# Altium schematic sheet main.SchDoc
size C
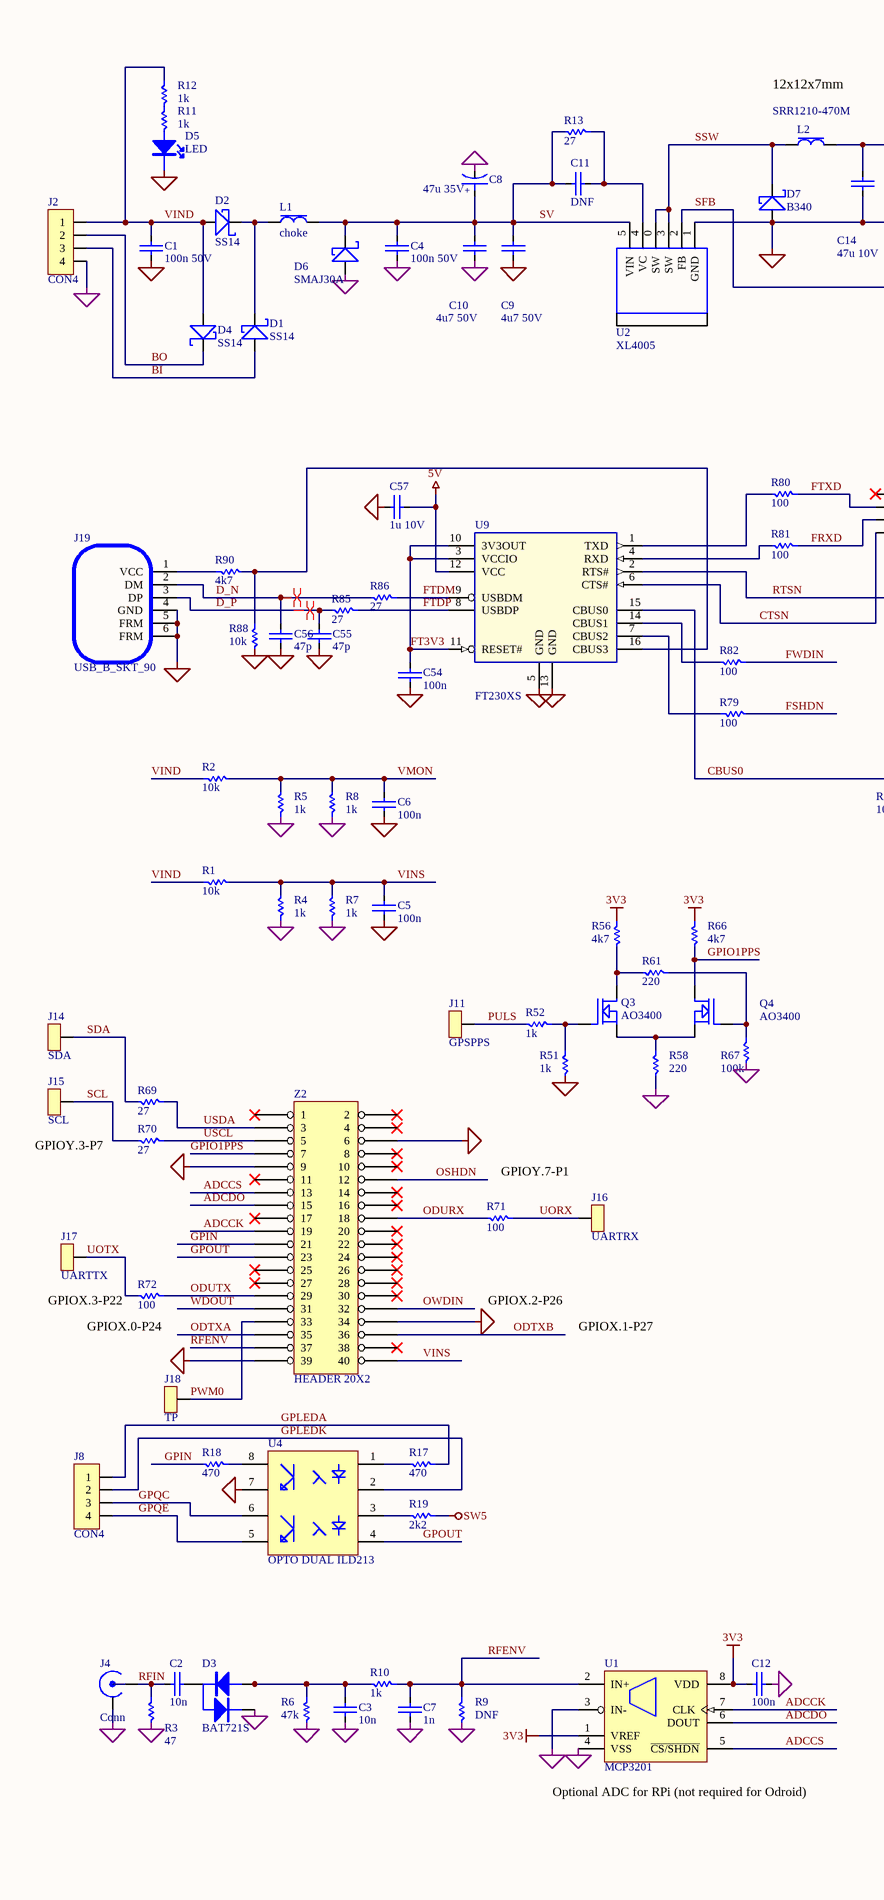
[diagram p0: main.SchDoc, left]
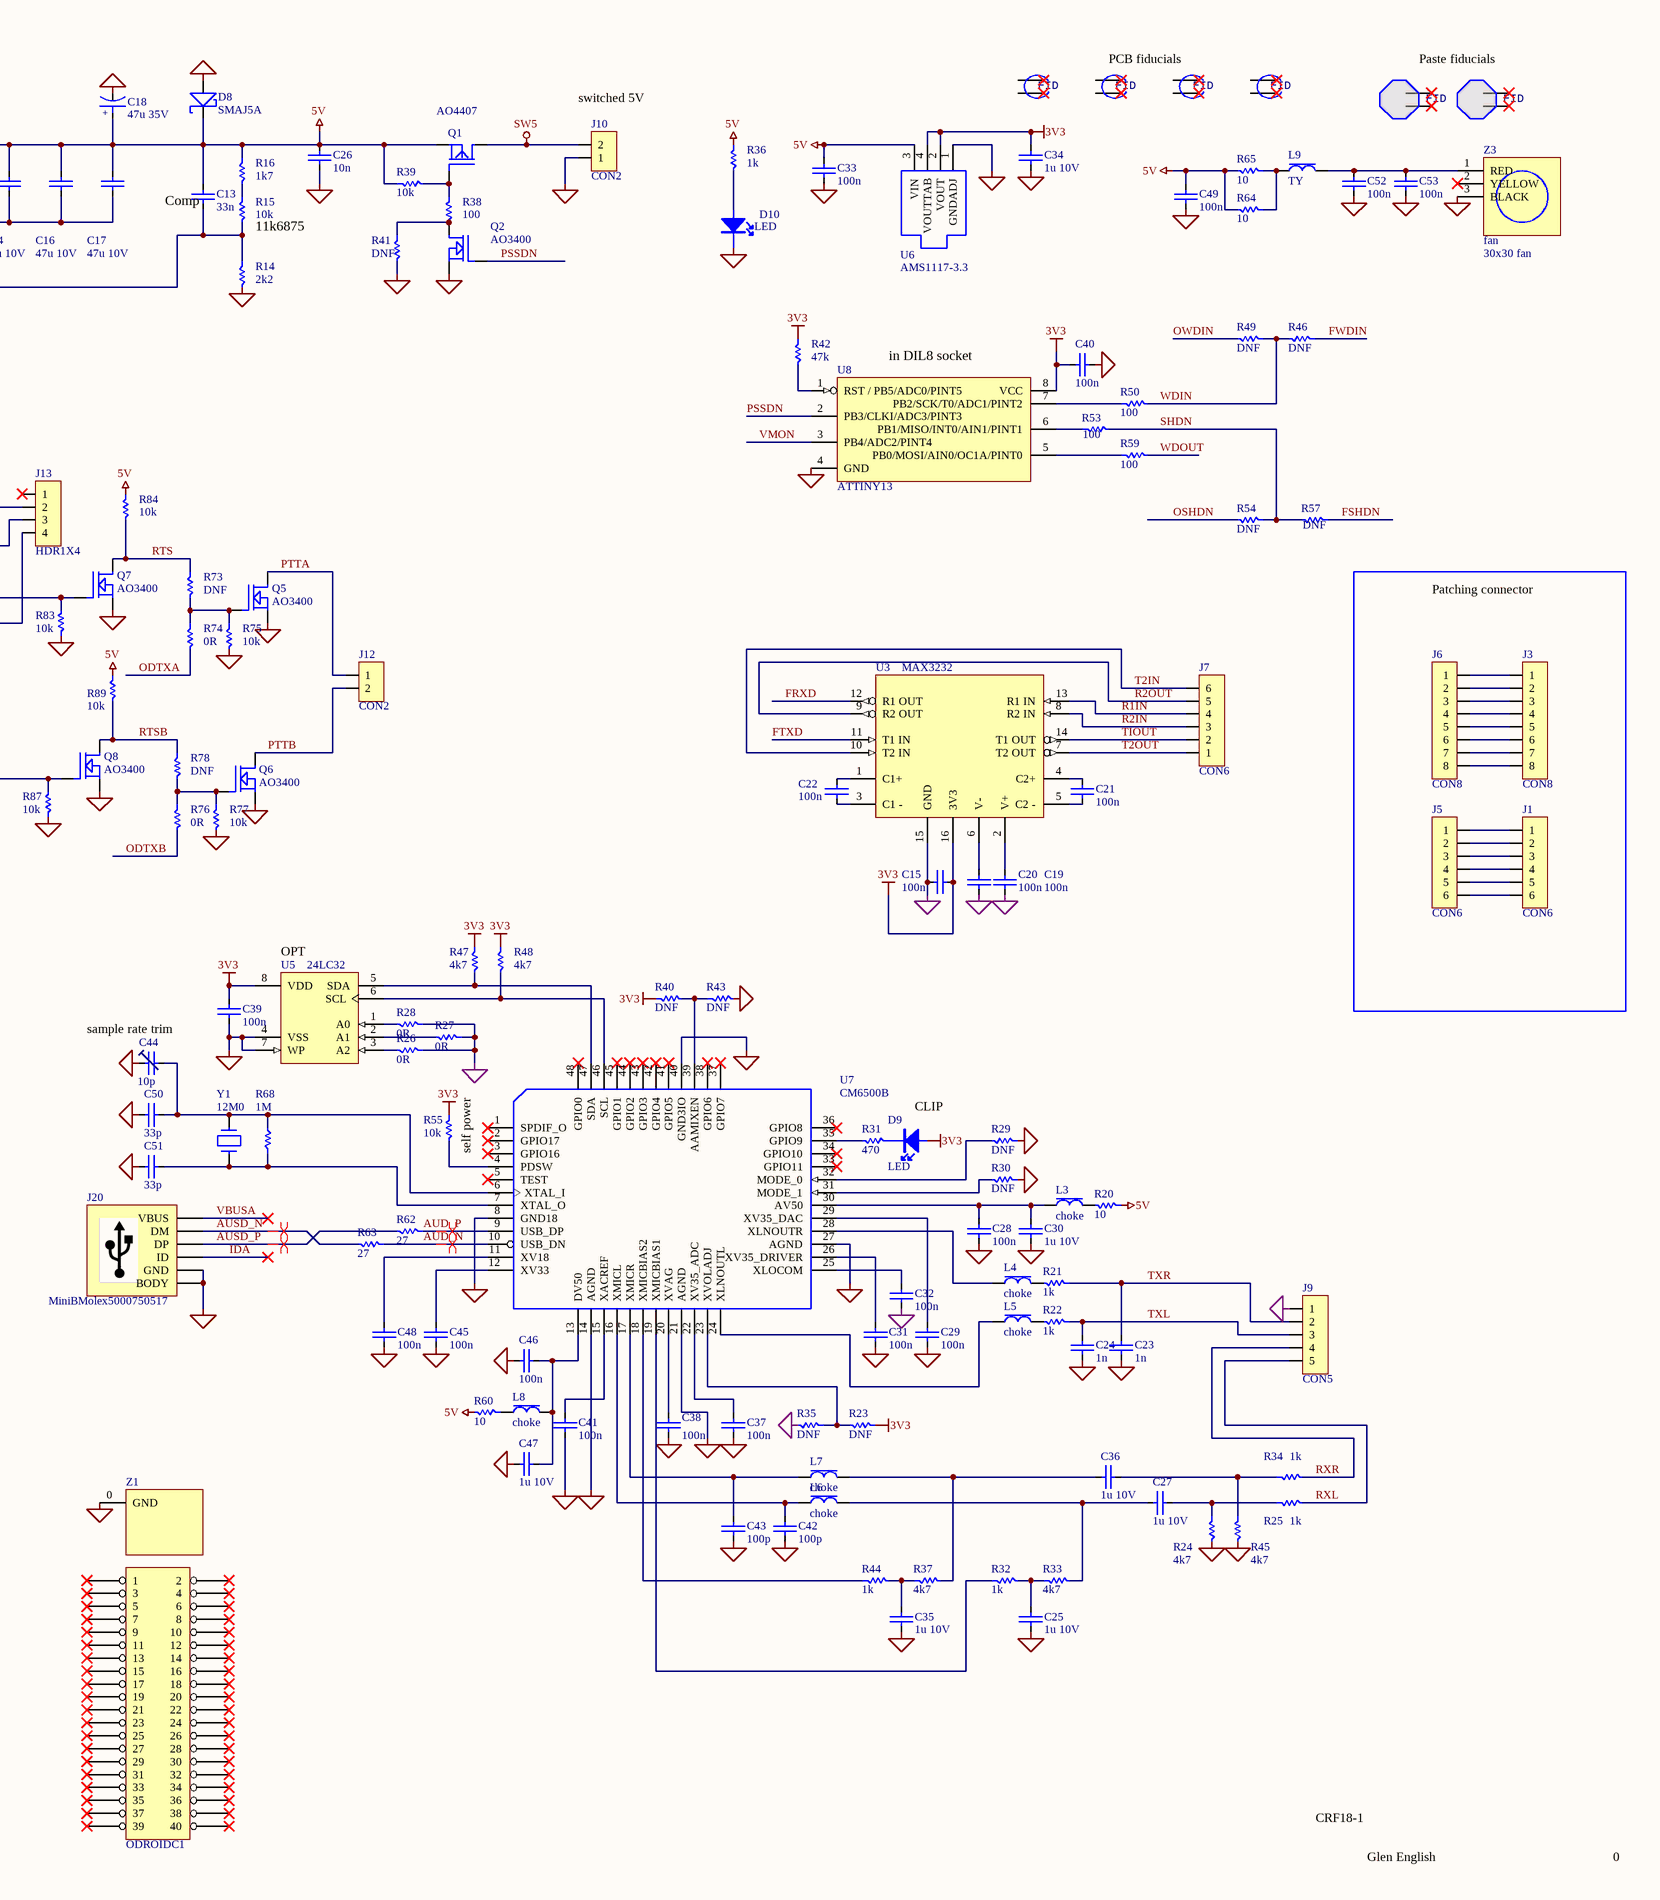
[diagram p1: main.SchDoc, right]

## Parts
C1  100n 50V  [0603C]
C2  10n  [0603C]
C3  10n  [0603C]
C4  100n 50V  [0603C]
C5  100n  [0603C]
C6  100n  [0603C]
C7  1n  [0603C]
C8  47u 35V  [D_CASE_ELECTRO]
C9  4u7 50V  [1206C]
C10  4u7 50V  [1206C]
C11  DNF  [0603C]
C12  100n  [0603C]
C13  33n  [0603C]
C14  47u 10V  [1206C]
C15  100n  [0603C]
C16  47u 10V  [1206C]
C17  47u 10V  [1206C]
C18  47u 35V  [D_CASE_ELECTRO]
C19  100n  [0603C]
C20  100n  [0603C]
C21  100n  [0603C]
C22  100n  [0603C]
C23  1n  [0603C]
C24  1n  [0603C]
C25  1u 10V  [0603C]
C26  10n  [0603C]
C27  1u 10V  [0603C]
C28  100n  [0603C]
C29  100n  [0603C]
C30  1u 10V  [0603C]
C31  100n  [0603C]
C32  100n  [0603C]
C33  100n  [0603C]
C34  1u 10V  [0603C]
C35  1u 10V  [0603C]
C36  1u 10V  [0603C]
C37  100n  [0603C]
C38  100n  [0603C]
C39  100n  [0603C]
C40  100n  [0603C]
C41  100n  [0603C]
C42  100p  [0603C]
C43  100p  [0603C]
C44  10p  [CAP0.1]
C45  100n  [0603C]
C46  100n  [0603C]
C47  1u 10V  [0603C]
C48  100n  [0603C]
C49  100n  [0603C]
C50  33p  [0603C]
C51  33p  [0603C]
C52  100n  [0603C]
C53  100n  [0603C]
C54  100n  [0603C]
C55  47p  [0603C]
C56  47p  [0603C]
C57  1u 10V  [0603C]
D1  SS14  [SMA_DIODE]
D2  SS14  [SMA_DIODE]
D3  BAT721S  [SOT23]
D4  SS14  [SMA_DIODE]
D5  LED  [0805LED]
D6  SMAJ30A  [SMA_DIODE]
D7  B340  [SMB_diode]
D8  SMAJ5A  [SMA_DIODE]
D9  LED  [0805LED]
D10  LED  [0805LED]
FID1  FIDUCIAL  [FIDUCIAL]  (value not drawn)
FID2  FIDUCIAL  [FIDUCIAL]  (value not drawn)
FID3  FIDUCIAL  [FIDUCIAL]  (value not drawn)
FID4  FIDUCIAL  [FIDUCIAL]  (value not drawn)
J1  CON6  [SL3.81/6/90G]
J2  CON4  [SL3.81/4/90G]
J3  CON8  [SL3.81/8/90G]
J4  Conn  [SMA_COMPACT_VERTICAL_PCB]
J5  CON6  [HDR1X6]
J6  CON8  [HDR1X8]
J7  CON6  [HDR1X6]
J8  CON4  [HDR1X4]
J9  CON5  [HDR1X5]
J10  CON2  [HDR1X2]
J11  GPSPPS  [GPPAD]
J12  CON2  [HDR1X2]
J13  HDR1X4  [HDR1X4]
J14  SDA  [GPPAD]
J15  SCL  [GPPAD]
J16  UARTRX  [GPPAD]
J17  UARTTX  [GPPAD]
J18  TP  [GPPAD]
J19  USB_B_SKT_90  [USB_B_SKT_90]
J20  MiniBMolex5000750517  [USB_UX60A-MB-5ST]
L1  choke  [1812L]
L2  SRR1210-470M  [BOURNS_SRR1210]
L3  choke  [0603L]
L4  choke  [0603L]
L5  choke  [0603L]
L6  choke  [0603L]
L7  choke  [0603L]
L8  choke  [0603L]
L9  TY  [0805L]
PFID1  PASTEFID  [FIDUCIAL_PASTE]  (value not drawn)
PFID2  PASTEFID  [FIDUCIAL_PASTE]  (value not drawn)
Q1  AO4407  [SO8FET]
Q2  AO3400  [FDV-301N_SOT23]
Q3  AO3400  [FDV-301N_SOT23]
Q4  AO3400  [FDV-301N_SOT23]
Q5  AO3400  [FDV-301N_SOT23]
Q6  AO3400  [FDV-301N_SOT23]
Q7  AO3400  [FDV-301N_SOT23]
Q8  AO3400  [FDV-301N_SOT23]
R1  10k  [0603R]
R2  10k  [0603R]
R3  47  [0603R]
R4  1k  [0603R]
R5  1k  [0603R]
R6  47k  [0603R]
R7  1k  [0603R]
R8  1k  [0603R]
R9  DNF  [0603R]
R10  1k  [0603R]
R11  1k  [0603R]
R12  1k  [0603R]
R13  27  [0603R]
R14  2k2  [0603R]
R15  10k  [0603R]
R16  1k7  [0603R]
R17  470  [0603R]
R18  470  [0603R]
R19  2k2  [0603R]
R20  10  [0603R]
R21  1k  [0603R]
R22  1k  [0603R]
R23  DNF  [0603R]
R24  4k7  [0603R]
R25  1k  [0603R]
R26  0R  [0603R]
R27  0R  [0603R]
R28  0R  [0603R]
R29  DNF  [0603R]
R30  DNF  [0603R]
R31  470  [0603R]
R32  1k  [0603R]
R33  4k7  [0603R]
R34  1k  [0603R]
R35  DNF  [0603R]
R36  1k  [0603R]
R37  4k7  [0603R]
R38  100  [0603R]
R39  10k  [0603R]
R40  DNF  [0603R]
R41  DNF  [0603R]
R42  47k  [0603R]
R43  DNF  [0603R]
R44  1k  [0603R]
R45  4k7  [0603R]
R46  DNF  [0603R]
R47  4k7  [0603R]
R48  4k7  [0603R]
R49  DNF  [0603R]
R50  100  [0603R]
R51  1k  [0603R]
R52  1k  [0603R]
R53  100  [0603R]
R54  DNF  [0603R]
R55  10k  [0603R]
R56  4k7  [0603R]
R57  DNF  [0603R]
R58  220  [0603R]
R59  100  [0603R]
R60  10  [0603R]
R61  220  [0603R]
R62  27  [0603R]
R63  27  [0603R]
R64  10  [1206R]
R65  10  [1206R]
R66  4k7  [0603R]
R67  100k  [0603R]
R68  1M  [0603R]
R69  27  [0603R]
R70  27  [0603R]
R71  100  [0603R]
R72  100  [0603R]
R73  DNF  [0603R]
R74  0R  [0603R]
R75  10k  [0603R]
R76  0R  [0603R]
R77  10k  [0603R]
R78  DNF  [0603R]
R79  100  [0603R]
R80  100  [0603R]
R81  100  [0603R]
R82  100  [0603R]
R83  10k  [0603R]
R84  10k  [0603R]
R85  27  [0603R]
R86  27  [0603R]
R87  10k  [0603R]
R88  10k  [0603R]
R89  10k  [0603R]
R90  4k7  [0603R]
U1  MCP3201  [DIP8]
U2  XL4005  [TO263-5]
U3  MAX3232  [SO16]
U4  OPTO DUAL ILD213  [SO8]
U5  24LC32  [SO8]
U6  AMS1117-3.3  [SOT223]
U7  CM6500B  [QFP48_7x7]
U8  ATTINY13  [DIP8]
U9  FT230XS  [TSSOP16]
Y1  12M0  [HC49]
Z1  ODROIDC1  [ODROID_C1]
Z2  HEADER 20X2  [HDR2X20_100MIL]
Z3  fan  [FAN_SUNON_MC3006]

## Blocks framed on the sheet
Patching connector: J1 J3 J5 J6

## Nets
3V3: C12.1 C15.1 C34.1 C39.2 C40.1 D9.A R23.1 R40.1 R42.1 R47.1 R48.1 R55.1 R56.1 R66.1 U1.1(VREF) U1.8(VDD) U3.16(3V3) U5.8(VDD) U6.2(VOUT) U6.4(VOUTTAB) U8.8(VCC)
5V: C13.1 C14.1 C16.1 C17.1 C18.1 C26.1 C33.1 C49.1 C57.1 D8.K(CATHODE) L2.2 Q1.S R16.1 R20.1 R36.1 R39.1 R60.2 R64.2 R65.2 R84.1 R89.1 U6.3(VIN) U9.12(VCC)
GND: C1.2 C3.2 C4.2 C5.2 C6.2 C7.1 C8.2 C9.2 C10.2 C12.2 C14.2 C15.2 C16.2 C17.2 C18.2 C19.1 C20.1 C23.2 C24.2 C25.2 C26.2 C28.1 C29.2 C30.1 C31.2 C32.2 C33.2 C34.2 C35.2 C37.2 C38.2 C39.1 C40.2 C41.2 C42.2 C43.2 C44.1 C45.2 C46.1 C47.1 C48.2 C49.2 C50.2 C51.2 C52.2 C53.2 C54.2 C55.1 C56.1 C57.2 D3.2(K2) D5.K D6.A(ANODE) D7.A(ANODE) D8.A(ANODE) D10.K J2.4 J4.1 J9.1 J10.1 J19.4(GND) J19.5(FRM) J19.6(FRM) J20.BODY J20.GND Q2.S Q5.S Q6.S Q7.S Q8.S R3.2 R4.1 R5.1 R6.2 R7.1 R8.1 R9.2 R14.2 R24.2 R26.1 R27.1 R28.1 R29.1 R30.1 R35.2 R41.2 R43.2 R45.2 R51.2 R58.2 R67.2 R75.2 R77.2 R83.1 R87.1 R88.2 U1.3(IN-) U1.4(VSS) U2.1(GND) U3.15(GND) U4.7(1E) U5.4(VSS) U5.7(WP) U6.1(GNDADJ) U7.8(GND18) U7.14(AGND) U7.21(AGND) U7.27(AGND) U7.40(GND3IO) U8.4(GND) U9.5(GND) U9.13(GND) Z1.0(GND) Z2.6 Z2.9 Z2.34 Z2.39 Z3.3(BLACK)
SW5: J10.2 Q1.D R19.1
ADCCK: U1.7(CLK) Z2.19
ADCCS: U1.5(~{CS/SHDN}) Z2.13
ADCDO: U1.6(DOUT) Z2.15
AUD_N: R63.1 U7.10(USB_DN)
AUD_P: R62.1 U7.9(USB_DP)
AUSD_N: J20.DM R63.2
AUSD_P: J20.DP R62.2
BI: D1.A(ANODE) J2.3
BO: D4.K(CATHODE) J2.2
CBUS0: Q8.G R87.2 U9.15(CBUS0)
CTSN: J13.4 U9.6(CTS#)
D_N: C56.2 J19.2(DM) R86.2
D_P: C55.2 J19.3(DP) R85.2
FRXD: J13.3 R81.1 U3.12(R1_OUT)
FSHDN: R57.1 R79.2
FT3V3: C54.1 U9.3(VCCIO) U9.10(3V3OUT) U9.11(RESET#)
FTDM: R86.1 U9.9(USBDM)
FTDP: R85.1 U9.8(USBDP)
FTXD: J13.2 R80.1 U3.11(T1_IN)
FWDIN: R46.1 R82.1
GPIN: R18.2 Z2.21
GPIO1PPS: Q4.D R66.2 Z2.7
GPLEDA: J8.1 R17.1
GPLEDK: J8.2 U4.2(1K)
GPOUT: U4.4(2K) Z2.23
GPQC: J8.3 U4.6(2C)
GPQE: J8.4 U4.5(2E)
IDA: J20.ID
ODTXA: R74.2 Z2.35
ODTXB: R76.2 Z2.36
ODURX: R71.2 Z2.18
ODUTX: R72.1 Z2.29
OSHDN: R54.2 Z2.12
OWDIN: R49.2 Z2.32
PSSDN: Q2.G U8.2(PB3/CLKI/ADC3/PINT3)
PTTA: J12.1 Q5.D
PTTB: J12.2 Q6.D
PULS: J11.0(TP) R52.2
PWM0: J18.0(TP) Z2.33
R1IN: J7.4 U3.13(R1_IN)
R2IN: J7.3 U3.8(R2_IN)
R2OUT: J7.5 U3.9(R2_OUT)
RFENV: C7.2 R9.1 R10.1 U1.2(IN+) Z2.37
RFIN: C2.1 J4.2 R3.1
RTS: Q7.D R73.1 R84.2
RTSB: Q8.D R78.1 R89.2
RTSN: Q7.G R83.2 U9.2(RTS#)
RXL: J9.5 R25.2
RXR: J9.4 R34.2
SCL: J15.0(TP) R70.2
SDA: J14.0(TP) R69.2
SFB: C13.2 R14.1 R15.2 U2.2(FB)
SHDN: R53.2 R54.1 R57.2
SSW: D7.K(CATHODE) L2.1 U2.0(SW) U2.3(SW)
SV: C4.1 C8.1 C9.1 C10.1 C11.1 D6.K(CATHODE) L1.2 R13.2 U2.5(VIN)
T2IN: J7.6 U3.10(T2_IN)
T2OUT: J7.1 U3.7(T2_OUT)
TIOUT: J7.2 U3.14(T1_OUT)
TXL: C24.1 J9.3 R22.1
TXR: C23.1 J9.2 R21.1
UORX: J16.0(TP) R71.1
UOTX: J17.0(TP) R72.2
USCL: R70.1 Z2.5
USDA: R69.1 Z2.3
VBUSA: J20.VBUS
VIND: C1.1 D2.A(ANODE) D4.A(ANODE) J2.1 R1.1 R2.1 R12.1
VINS: C5.1 R1.2 R4.2 R7.2 Z2.40
VMON: C6.1 R2.2 R5.2 R8.2 U8.3(PB4/ADC2/PINT4)
WDIN: R46.2 R49.1 R50.2
WDOUT: R59.2 Z2.31
NetC2_2: C2.2 D3.3(B)
NetC3_1: C3.1 D3.1(K1) R6.1 R10.2
NetC11_2: C11.2 R13.1 U2.4(VC)
NetC19_2: C19.2 U3.2(V+)
NetC20_2: C20.2 U3.6(V-)
NetC21_1: C21.1 U3.4(C2+)
NetC21_2: C21.2 U3.5(C2_-)
NetC22_1: C22.1 U3.1(C1+)
NetC22_2: C22.2 U3.3(C1_-)
NetC25_1: C25.1 R32.2 R33.1
NetC27_1: C27.1 L6.2 R33.2
NetC27_2: C27.2 R24.1 R25.1
NetC28_2: C28.2 C30.2 L3.1 U7.30(AV50)
NetC29_1: C29.1 U7.29(XV35_DAC)
NetC31_1: C31.1 U7.26(XV35_DRIVER)
NetC32_1: C32.1 U7.25(XLOCOM)
NetC35_1: C35.1 R37.1 R44.2
NetC36_1: C36.1 L7.2 R37.2
NetC36_2: C36.2 R34.1 R45.1
NetC37_1: C37.1 U7.22(XV35_ADC)
NetC38_1: C38.1 U7.20(XVAG)
NetC41_1: C41.1 U7.15(XACREF)
NetC42_1: C42.1 L6.1 U7.16(XMICL)
NetC43_1: C43.1 L7.1 U7.17(XMICR)
NetC44_2: C44.2 C50.1 R68.2 U7.6(XTAL_I) Y1.1
NetC45_1: C45.1 U7.12(XV33)
NetC46_2: C46.2 C47.2 L8.2 U7.13(DV50)
NetC48_1: C48.1 U7.11(XV18)
NetC51_1: C51.1 R68.1 U7.7(XTAL_O) Y1.2
NetC52_1: C52.1 C53.1 L9.2 Z3.1(RED)
NetD1_K: D1.K(CATHODE) D2.K(CATHODE) L1.1
NetD5_A: D5.A R11.2
NetD9_K: D9.K R31.1
NetD10_A: D10.A R36.2
NetJ1_1: J1.1 J5.1
NetJ1_2: J1.2 J5.2
NetJ1_3: J1.3 J5.3
NetJ1_4: J1.4 J5.4
NetJ1_5: J1.5 J5.5
NetJ1_6: J1.6 J5.6
NetJ3_1: J3.1 J6.1
NetJ3_2: J3.2 J6.2
NetJ3_3: J3.3 J6.3
NetJ3_4: J3.4 J6.4
NetJ3_5: J3.5 J6.5
NetJ3_6: J3.6 J6.6
NetJ3_7: J3.7 J6.7
NetJ3_8: J3.8 J6.8
NetJ19_1: J19.1(VCC) R90.1
NetL3_2: L3.2 R20.2
NetL4_1: L4.1 U7.28(XLNOUTR)
NetL4_2: L4.2 R21.2
NetL5_1: L5.1 U7.24(XLNOUTL)
NetL5_2: L5.2 R22.2
NetL8_1: L8.1 R60.1
NetL9_1: L9.1 R64.1 R65.1
NetQ1_G: Q1.G R38.1 R39.2
NetQ2_D: Q2.D R38.2 R41.1
NetQ3_D: Q3.D R56.2 R61.2
NetQ3_G: Q3.G R51.1 R52.1
NetQ3_S: Q3.S Q4.S R58.1
NetQ4_G: Q4.G R61.1 R67.1
NetQ5_G: Q5.G R73.2 R74.1 R75.1
NetQ6_G: Q6.G R76.1 R77.1 R78.2
NetR11_1: R11.1 R12.2
NetR15_1: R15.1 R16.2
NetR17_2: R17.2 U4.1(1A)
NetR18_1: R18.1 U4.8(1C)
NetR19_2: R19.2 U4.3(2A)
NetR23_2: R23.2 R35.1 U7.23(XVOLADJ)
NetR26_2: R26.2 U5.3(A2)
NetR27_2: R27.2 U5.2(A1)
NetR28_2: R28.2 U5.1(A0)
NetR29_2: R29.2 U7.32(MODE_0)
NetR30_2: R30.2 U7.31(MODE_1)
NetR31_2: R31.2 U7.35(GPIO9)
NetR32_1: R32.1 U7.19(XMICBIAS1)
NetR40_2: R40.2 R43.1 U7.39(AAMIXEN)
NetR42_2: R42.2 U8.1(RST_/_PB5/ADC0/PINT5)
NetR44_1: R44.1 U7.18(XMICBIAS2)
NetR47_2: R47.2 U5.5(SDA) U7.47(SDA)
NetR48_2: R48.2 U5.6(SCL) U7.46(SCL)
NetR50_1: R50.1 U8.7(PB2/SCK/T0/ADC1/PINT2)
NetR53_1: R53.1 U8.6(PB1/MISO/INT0/AIN1/PINT1)
NetR55_2: R55.2 U7.4(PDSW)
NetR59_1: R59.1 U8.5(PB0/MOSI/AIN0/OC1A/PINT0)
NetR79_1: R79.1 U9.7(CBUS2)
NetR80_2: R80.2 U9.1(TXD)
NetR81_2: R81.2 U9.4(RXD)
NetR82_2: R82.2 U9.14(CBUS1)
NetR88_1: R88.1 R90.2 U9.16(CBUS3)

Not connected (* = marked no-connect by the designer): FID1 0* 1*; FID2 0* 1*; FID3 0* 1*; FID4 0* 1*; J13 1*; PFID1 0* 1*; PFID2 0* 1*; U7 1(SPDIF_O)* 2(GPIO17)* 3(GPIO16)* 5(TEST)* 33(GPIO11)* 34(GPIO10)* 36(GPIO8)* 37(GPIO7)* 38(GPIO6)* 41(GPIO5)* 42(GPIO4)* 43(GPIO3)* 44(GPIO2)* 45(GPIO1)* 48(GPIO0)*; Z1 1* 2* 3* 4* 5* 6* 7* 8* 9* 10* 11* 12* 13* 14* 15* 16* 17* 18* 19* 20* 21* 22* 23* 24* 25* 26* 27* 28* 29* 30* 31* 32* 33* 34* 35* 36* 37* 38* 39* 40*; Z2 1* 2* 4* 8* 10* 11* 14* 16* 17* 20* 22* 24* 25* 26* 27* 28* 30* 38*; Z3 2(YELLOW)*

## Layout directives
differential pair: AUD_N, AUD_P, AUSD_N, AUSD_P, D_N, D_P

## Notes on the sheet
- 12x12x7mm
- PCB fiducials
- Paste fiducials
- (near J10) switched 5V
- (near C13) Comp
- (near R15) 11k6875
- 30x30 fan
- (near U8) in DIL8 socket
- (near U5) OPT
- sample rate trim
- CLIP
- GPIOY.3-P7
- GPIOY.7-P1
- (near R55) self power
- (near R72) GPIOX.3-P22
- GPIOX.2-P26
- (near R72) GPIOX.0-P24
- GPIOX.1-P27
- (near U1) Optional ADC for RPi (not required for Odroid)
- CRF18-1
- Glen English
- 0
- (in symbol cap-pols) +
- (in symbol FIDUCIAL) FID
- (in symbol FIDUCIAL_PASTE) FID

## Library data of the parts
C1-C7 C12-C17 C19-C43 C45-C49 C52-C57 = caps
C8 C18 = cap-pols: capacitor polarized
C9-C11 = caps: DKPN: 587-1778-1-ND
C44 = CAPTRIM: trimmer cap
C50 C51 = cryst
D1 D2 D4 D6-D8 = DIODE_SHOTT_AK_SMALL: schottky
D3 = BAT721A-DUALDIODE_COM_ANODE_1: dual diode series
D5 D9 D10 = LEDS
FID1-FID4 = FIDUCIAL: fiducial mark
J4 = CoaxConn: coax connector
J11 J14-J18 = TESTPOINT: test point
J13 = CON4
J19 = USB_B_SKT
J20 = USB_MiniB_molex: USB socket miniB
L1 = inductorshort
L2 = INDUCTORSHORT: XAL4040-103
L3-L9 = INDUCTORSHORT
PFID1 PFID2 = FIDUCIAL_PASTE: fiducial mark paste
Q1 = FDC638P: mosfet digital
Q2-Q8 = MOSFET-DIGITAL-SOT-23_1: FDV301N
R1-R13 R16-R90 = ress: resistor small
R14 R15 = RESS: resistor small
U1 = MCP3201: 12bit 2 channel 55kbps spi adc
U2 = XL4015: buck regulator 4A
U3 = MAX3232: 3.3V rs232 transceiver
U4 = OPTO DUAL ILD213: dual sm opto Vishay
U5 = 24C_EEPROM: eeprom 8 pin
U6 = AMS1117: 3.3V LDO
U7 = CM6500B: USB audio
U8 = ATTINY13: microcontroller
U9 = FT230XS: ftdi uart ssop16
Y1 = CRYSTAL
Z1 = ODROIDC1: ODROID SBC
Z3 = Fan_Sunon_maglev_MC3006: sunon fan